# EAGLE design BpodNlxSync (EAGLE 6.3)
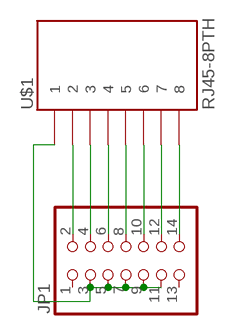
[diagram p0: schematic, sheet 1]

## Parts
JP1  PINHD-2X7/90  [2X07/90]
U$1  RJ45-8PTH  [RJ45-8]

## Nets
N$1: JP1.3 JP1.5 JP1.7 JP1.9 JP1.11 U$1.1
N$2: JP1.2 U$1.2
N$3: JP1.4 U$1.3
N$4: JP1.6 U$1.4
N$5: JP1.8 U$1.5
N$6: JP1.10 U$1.6
N$7: JP1.12 U$1.7
N$8: JP1.14 U$1.8
Unconnected: JP1.1 JP1.13

## Library data of the parts
JP1 = pinhead:PINHD-2X7: PIN HEADER
U$1 = SparkFun-Connectors:RJ45-8: RJ45 Jack Simple RJ45, 8-pin connection - connector for common Cat5, Cat5e, and Cat6 Ethernet cables. Footprint not yet proven in production. Connector sku is PRT-00643; Breakout PCB sku is BOB-00716.

## Board
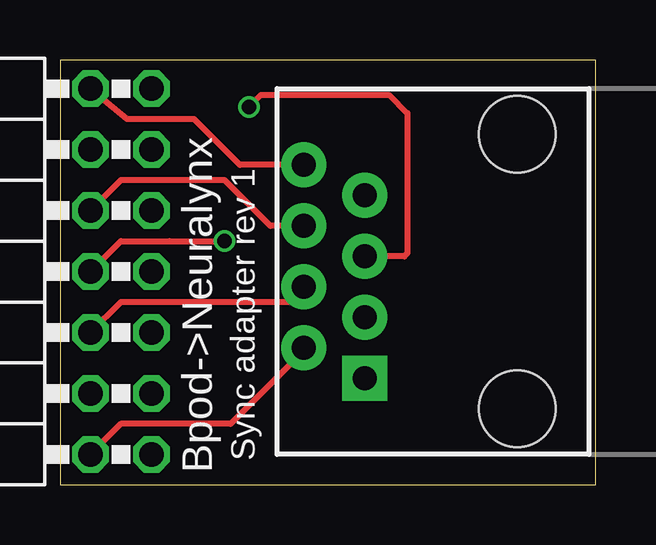
[diagram p1: board, top side]
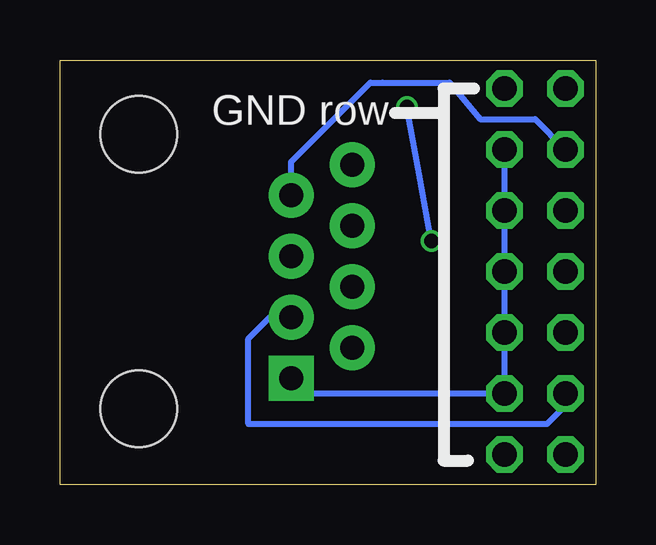
[diagram p2: board, bottom side, seen from below]

Size 22.33 x 17.7 mm. Coordinates in mm from the lower left corner, seen from the top.
Outline: 0,0 22.33,0 22.33,17.7 0,17.7 0,0
Copper layers (1*16): Top 0.035mm / dielectric 1.5mm / Bottom 0.035mm
Design rules "SeeedStudio_2layer_DRU_no_angle_20140221": minimum track width 6mil, minimum drill 12mil, track to track 6mil, track to pad 6mil, pad to pad 6mil, via to via 6mil, smd to smd 0mil, copper to edge 10mil, drill to drill 10mil, minimum pad ring 10mil, minimum via ring 6mil, stop-mask expansion 2mil, vias tented up to drill 100mil, thermal gap 10mil

### Footprints (pad centres in the part's own frame; a part is rotated, then mirrored left to right if it is on the bottom)
2X07/90 = drill 1.016 octagon: 1 -7.62,-6.35; 2 -7.62,-3.81; 3 -5.08,-6.35; 4 -5.08,-3.81; 5 -2.54,-6.35; 6 -2.54,-3.81; 7 0,-6.35; 8 0,-3.81; 9 2.54,-6.35; 10 2.54,-3.81; 11 5.08,-6.35; 12 5.08,-3.81; 13 7.62,-6.35; 14 7.62,-3.81
RJ45-8 = drill 1 pad 1.88 square: 1 -4.445,6.35 | drill 1 pad 1.88: 2 -3.175,8.89; 3 -1.905,6.35; 4 -0.635,8.89; 5 0.635,6.35; 6 1.905,8.89; 7 3.175,6.35; 8 4.445,8.89 | hole 3.2: -5.715,0; 5.715,0

### Placement (x,y rotation side)
JP1  -2.54,8.89 90 top
U$1  19.05,8.89 90 top

### Tracks (layer width: path | path; a pad name or v marks a point on that pad's centre or on a via)
N$1
  Bottom 0.254: U$1.1 12.06,3.81 JP1.3 JP1.5 JP1.7 JP1.9 JP1.11
N$2
  Top 0.254: U$1.2 10.16,5.59 7.11,2.54 2.54,2.54 JP1.2
N$3
  Bottom 0.254: JP1.4 1.27,3.3 2.03,2.54 14.48,2.54 14.48,6.1 13.59,6.99 U$1.3
N$4
  Top 0.254: U$1.4 9.53,7.62 2.54,7.62 JP1.6
N$5  (via drill 0.6)
  Top 0.254: JP1.8 2.54,10.16 4.57,10.16 v6.86,10.16 | v7.87,15.75 8.38,16.26 13.72,16.26 14.48,15.49 14.48,9.65 14.35,9.53 U$1.5
  Bottom 0.254: v6.86,10.16 7.37,12.95 v7.87,15.75
N$6
  Top 0.254: U$1.6 8.76,10.79 6.86,12.7 2.54,12.7 JP1.10
N$7
  Bottom 0.254: U$1.7 12.7,13.46 10.92,15.24 9.4,16.76 8.89,16.76 6.1,16.76 4.83,15.24 2.54,15.24 JP1.12
N$8
  Top 0.254: U$1.8 9.53,13.34 7.49,13.34 5.59,15.24 2.79,15.24 JP1.14

### Text on the board
tPlace: Bpod->Neuralynx | Sync adapter rev 1
bPlace: GND row